# Altium schematic sheet 05-Switch_SFP_CM4_RJ45.SchDoc
size B; SheetNumber: 5; SheetTotal: 11
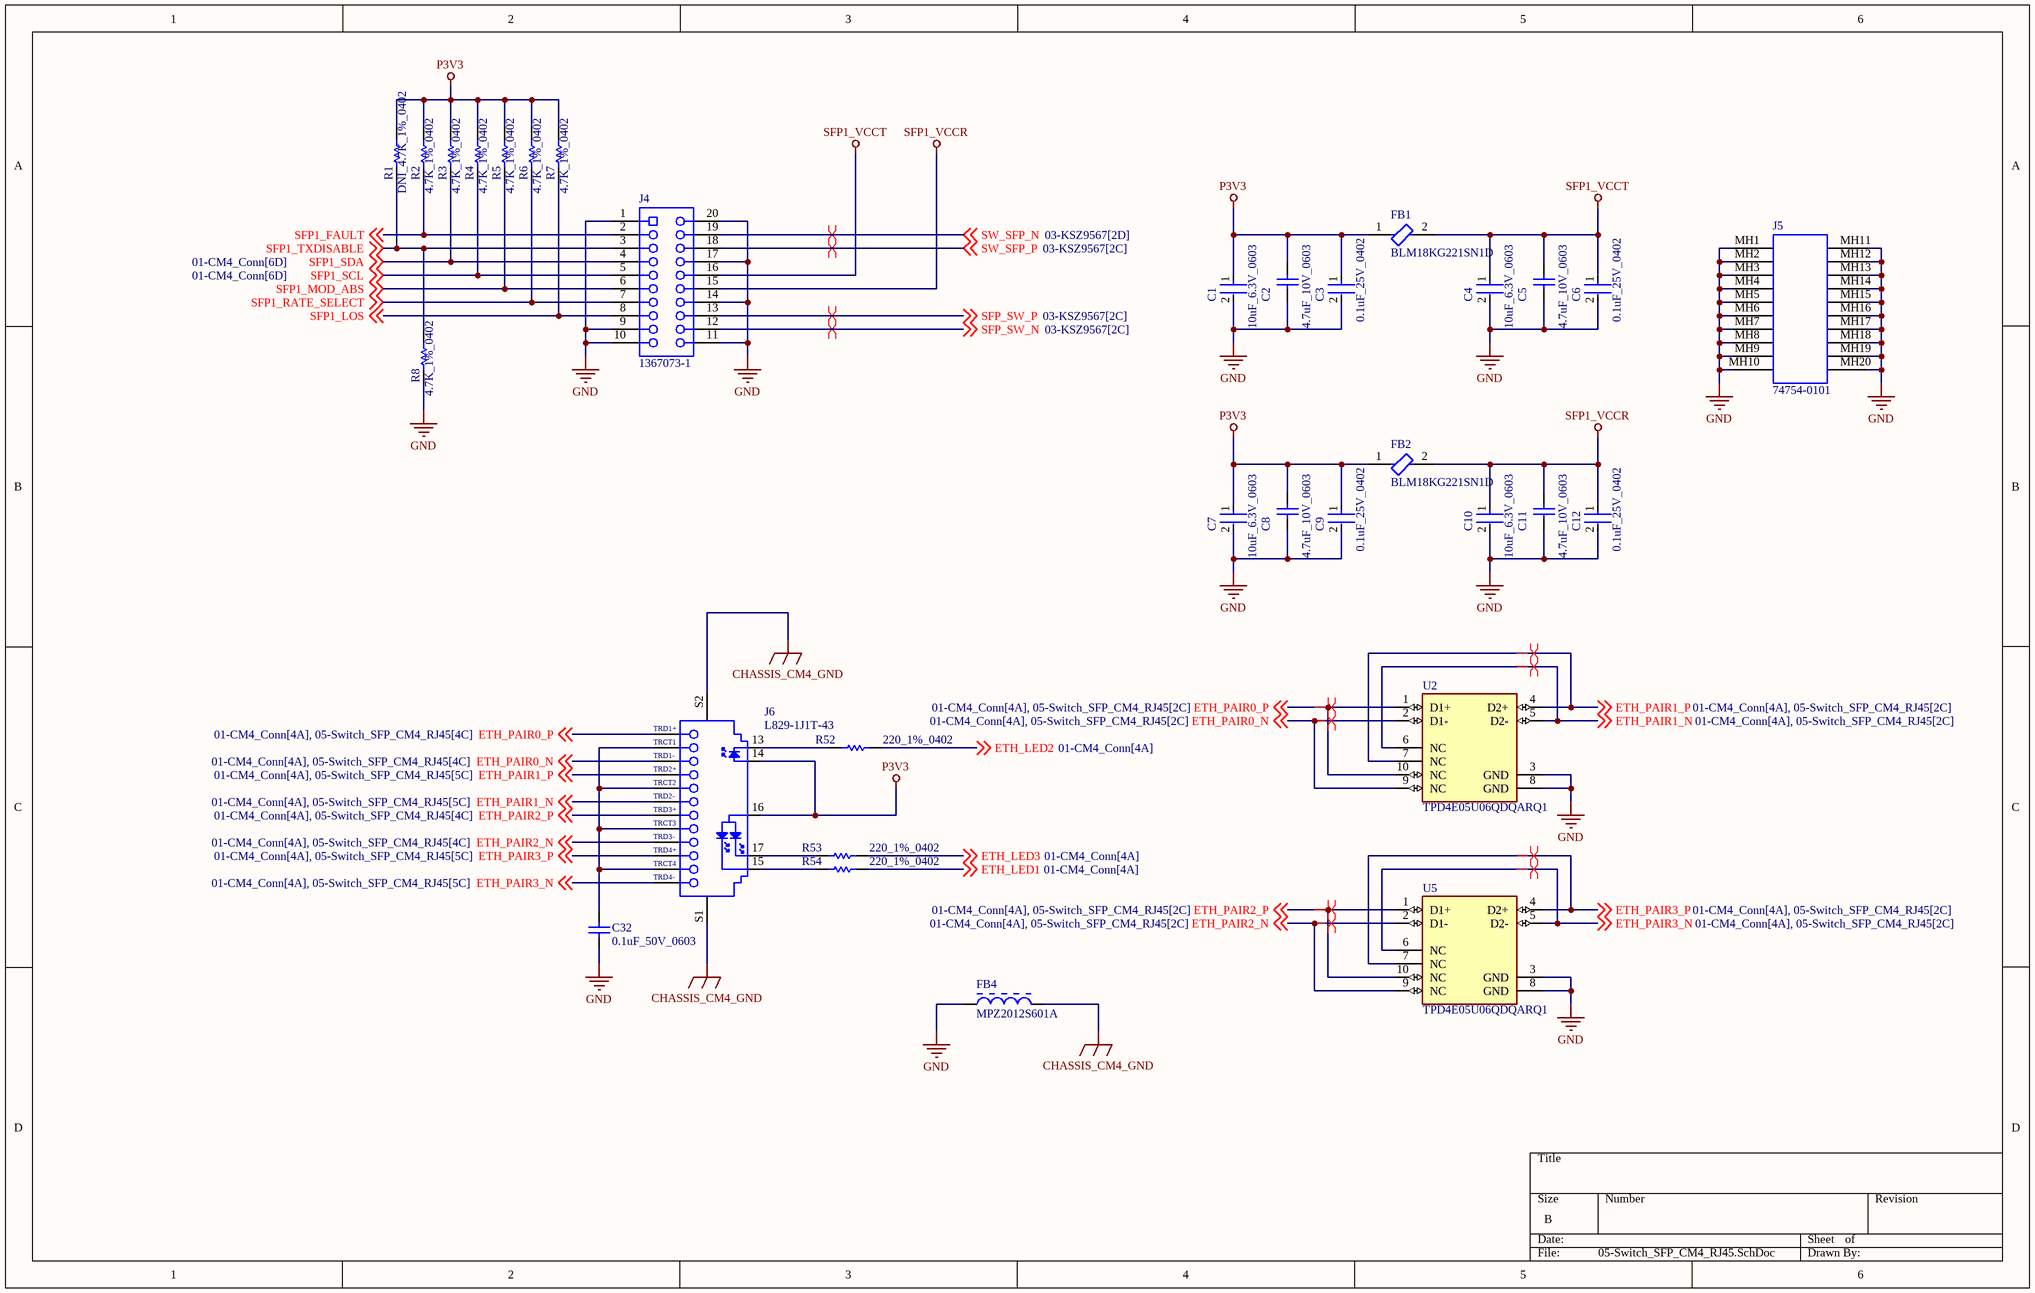
[diagram p0: 05-Switch_SFP_CM4_RJ45.SchDoc]

## Parts
C1  10uF_6.3V_0603  [FP-C0603C106M9PACTU-MFG]
C2  4.7uF_10V_0603  [CAPC1608X87X35NL15T15]
C3  0.1uF_25V_0402  [FP-0402-L_1_0_1-W_0_5_0_1-IPC_C]
C4  10uF_6.3V_0603  [FP-C0603C106M9PACTU-MFG]
C5  4.7uF_10V_0603  [CAPC1608X87X35NL15T15]
C6  0.1uF_25V_0402  [FP-0402-L_1_0_1-W_0_5_0_1-IPC_C]
C7  10uF_6.3V_0603  [FP-C0603C106M9PACTU-MFG]
C8  4.7uF_10V_0603  [CAPC1608X87X35NL15T15]
C9  0.1uF_25V_0402  [FP-0402-L_1_0_1-W_0_5_0_1-IPC_C]
C10  10uF_6.3V_0603  [FP-C0603C106M9PACTU-MFG]
C11  4.7uF_10V_0603  [CAPC1608X87X35NL15T15]
C12  0.1uF_25V_0402  [FP-0402-L_1_0_1-W_0_5_0_1-IPC_C]
C32  0.1uF_50V_0603  [CAPC1608X90X35ML10T15]
FB1  BLM18KG221SN1D  [FP-BLM18-0_15-t0_8-IPC_B]
FB2  BLM18KG221SN1D  [FP-BLM18-0_15-t0_8-IPC_B]
FB4  MPZ2012S601A  [TDK-MPZ2012_V]
J4  1367073-1  [TECO-1367073-1_V]
J5  74754-0101  [MOLX-74754-0101_V]
J6  L829-1J1T-43  [BELS-L829-1J1T-43_V]
R1  DNI_4.7K_1%_0402  [RESC1005X40X25NL10T10]  (no BOM)
R2  4.7K_1%_0402  [RESC1005X40X25NL10T10]
R3  4.7K_1%_0402  [RESC1005X40X25NL10T10]
R4  4.7K_1%_0402  [RESC1005X40X25NL10T10]
R5  4.7K_1%_0402  [RESC1005X40X25NL10T10]
R6  4.7K_1%_0402  [RESC1005X40X25NL10T10]
R7  4.7K_1%_0402  [RESC1005X40X25NL10T10]
R8  4.7K_1%_0402  [RESC1005X40X25NL10T10]
R52  220_1%_0402  [RESC1005X40X25NL05T10]
R53  220_1%_0402  [RESC1005X40X25NL05T10]
R54  220_1%_0402  [RESC1005X40X25NL05T10]
U2  TPD4E05U06QDQARQ1  [FP-DQA0010A-MFG]
U5  TPD4E05U06QDQARQ1  [FP-DQA0010A-MFG]

## Nets
CHASSIS_CM4_GND: FB4.2 J6.S1 J6.S2
GND: C1.2 C2.1 C3.2 C4.2 C5.1 C6.2 C7.2 C8.1 C9.2 C10.2 C11.1 C12.2 C32.1 FB4.1 J4.1 J4.9 J4.10 J4.11 J4.14 J4.17 J4.20 J5.MH1 J5.MH2 J5.MH3 J5.MH4 J5.MH5 J5.MH6 J5.MH7 J5.MH8 J5.MH9 J5.MH10 J5.MH11 J5.MH12 J5.MH13 J5.MH14 J5.MH15 J5.MH16 J5.MH17 J5.MH18 J5.MH19 J5.MH20 R8.2 U2.3(GND) U2.8(GND) U5.3(GND) U5.8(GND)
P3V3: C1.1 C2.2 C3.1 C7.1 C8.2 C9.1 FB1.1 FB2.1 J6.14 J6.16 R1.1 R2.1 R3.1 R4.1 R5.1 R6.1 R7.1
SFP1_VCCR: C10.1 C11.2 C12.1 FB2.2 J4.15
SFP1_VCCT: C4.1 C5.2 C6.1 FB1.2 J4.16
ETH_LED1: R54.2 ; off-sheet ETH_LED1
ETH_LED2: R52.2 ; off-sheet ETH_LED2
ETH_LED3: R53.2 ; off-sheet ETH_LED3
ETH_PAIR0_N: J6.3(TRD1-) U2.2(D1-) U2.9(NC) ; off-sheet ETH_PAIR0_N
ETH_PAIR0_P: J6.1(TRD1+) U2.1(D1+) U2.10(NC) ; off-sheet ETH_PAIR0_P
ETH_PAIR1_N: J6.6(TRD2-) U2.5(D2-) U2.6(NC) ; off-sheet ETH_PAIR1_N
ETH_PAIR1_P: J6.4(TRD2+) U2.4(D2+) U2.7(NC) ; off-sheet ETH_PAIR1_P
ETH_PAIR2_N: J6.9(TRD3-) U5.2(D1-) U5.9(NC) ; off-sheet ETH_PAIR2_N
ETH_PAIR2_P: J6.7(TRD3+) U5.1(D1+) U5.10(NC) ; off-sheet ETH_PAIR2_P
ETH_PAIR3_N: J6.12(TRD4-) U5.5(D2-) U5.6(NC) ; off-sheet ETH_PAIR3_N
ETH_PAIR3_P: J6.10(TRD4+) U5.4(D2+) U5.7(NC) ; off-sheet ETH_PAIR3_P
SFP1_FAULT: J4.2 R2.2 ; off-sheet SFP1_FAULT
SFP1_LOS: J4.8 R7.2 ; off-sheet SFP1_LOS
SFP1_MOD_ABS: J4.6 R5.2 ; off-sheet SFP1_MOD_ABS
SFP1_RATE_SELECT: J4.7 R6.2 ; off-sheet SFP1_RATE_SELECT
SFP1_SCL: J4.5 R4.2 ; off-sheet SFP1_SCL
SFP1_SDA: J4.4 R3.2 ; off-sheet SFP1_SDA
SFP1_TXDISABLE: J4.3 R1.2 R8.1 ; off-sheet SFP1_TXDISABLE
SFP_SW_N: J4.12 ; off-sheet SFP_SW_N
SFP_SW_P: J4.13 ; off-sheet SFP_SW_P
SW_SFP_N: J4.19 ; off-sheet SW_SFP_N
SW_SFP_P: J4.18 ; off-sheet SW_SFP_P
NetC32_2: C32.2 J6.2(TRCT1) J6.5(TRCT2) J6.8(TRCT3) J6.11(TRCT4)
NetJ6_13: J6.13 R52.1
NetJ6_15: J6.15 R54.1
NetJ6_17: J6.17 R53.1

## Layout directives
differential pair: ETH_PAIR0_N, ETH_PAIR0_P, ETH_PAIR1_N, ETH_PAIR1_P, ETH_PAIR2_N, ETH_PAIR2_P, ETH_PAIR3_N, ETH_PAIR3_P, SFP_SW_N, SFP_SW_P, SW_SFP_N, SW_SFP_P

## Library data of the parts
C1 C4 C7 C10 = CMP-2006-02285-3: CAP CER 10UF 6.3V X5R 0603; Manufacturer Part Number: C0603C106M9PACTU; Manufacturer: Kemet; Material: Ceramic; Temperature Coefficient: 15%; Tolerance: 20%; Category: Cap; Height: 0.9mm; Digikey Description: CAP CER 10UF 6.3V X5R 0603; Mouser Description: In a Pack of 10, KEMET 0603 (1608M) 10µF MLCC 6.3V dc ±20% SMD C0603C106M9PACTU; Voltage Rating: 6.3V; Device Class L2: Capacitors; Temperature Range Low: -55°C; Temperature Characteristic: X5R; ComponentLink2Description: Datasheet; Ipc Land Pattern Name: CAPC16080X80; ComponentLink2URL: http://www.kemet.com/Lists/ProductCatalog/Attachments/19/KEM_C1006_X5R_SMD.pdf; Capacitance: 10uF; Temperature Range High: +85°C; Device Class L3: Ceramic Capacitors; RoHS: TRUE; Automotive: No; Value: 10uF; Temperature: -55°C to +85°C; Device Class L1: Passive Components; Package: C0603C106M9PACTU; Lead Free: Yes; Octopart: https://octopart.com/c0603c106m9pactu-kemet-8375727
C2 C5 C8 C11 = CMP-2006-03238-1: Part Number: C0603C475K8PACTU; Manufacturer: Kemet
C3 C6 C9 C12 = CMP-2008-02519-2: General Purpose Ceramic Capacitor, 0402, 100nF, 10%, X7R, 15%, 25V; Package Quantity: 1; Capacitance: 100nF; Min Operating Temperature: -55°C; Voltage: 25V; Voltage Rating: 25V; Construction: Flat; Max Operating Temperature: 125°C; Radiation Hardening: No; Depth: 0.5mm; Thickness: 0.022inch; Voltage Rating (DC): 25V; Number of Pins: 2; Lead Free: Lead Free; Series: -; REACH SVHC: No SVHC; Length: 1mm; Dielectric: X7R; RoHS Compliant: Yes; Mount: Surface Mount; Packaging: Tape and Reel; Case/Package: 0402; Case Code (Imperial): 0402; Termination: SMD/SMT; Width: 0.02inch; Case Code (Metric): 1005; Tolerance: 10%
C32 = CMP-2100-03643-1: Chip Capacitor, 0.1 uF, +/- 10%, 50 V, -55 to 125 degC, 0603 (1608 Metric), RoHS, Tape and Reel; Manufacturer: Murata; Dielectric Material: Ceramic; Voltage Rating: 50V; Capacitance: 100nF; Dielectric: X7R; Insulation Resistance: 10GR; Case Code (Metric): 1608; Lead Free: LeadFree; Depth: 0.8mm; Number of Pins: 2; Radiation Hardening: No; Case/Package: 0603; Manufacturer URL: http://www.murata.com/; Packaging: TapeandReel; Length: 1.6mm; Contact Plating: Tin; Datasheet URL: http://psearch.en.murata.com/capacitor/product/GRM188R71H104KA93%23.pdf; Tolerance: 10%; Case Code (Imperial): 0603; Min Operating Temperature: -55degC; RoHSCompliant: true; Voltage: 50V; Termination: SMD/SMT; Mount: SurfaceMount; Material: Ceramic; Package Quantity: 1; Height: 0.8mm; Thickness: 0.035inch; REACH SVHC: NoSVHC; Max Operating Temperature: 125degC; Width: 0.8mm; Package Reference: 0603; Voltage Rating (DC): 50V; Datasheet Version: 42675.0; Package Description: 2-Pin Surface Mount Device, Body 1.6 x 0.8 mm
FB1 FB2 = CMP-0686-00556-7: Chip Ferrite Bead, 0603, 220Ω @ 100MHz, 0.05Ω, 25%, 2.2A; DC Resistance (DCR): 50mR; Number of Circuits: 1; Impedance: 220R; Current Rating: 2.2A; Material: Ferrite; Test Frequency: 100MHz; Depth: 0.8mm; Series: BLM18K; RoHS Compliant: Yes; Termination: SMD/SMT; Max Current Rating: 2.2A; Case Code (Metric): 1608; Radiation Hardening: No; Number of Pins: 2; Length: 1.6mm; Lead Free: Lead Free; Package Quantity: 1; Height: 0.8mm; Core Material: Ferrite; Inductor Type: FERRITE BEAD; Min Operating Temperature: -55°C; Case/Package: 0603; Case Code (Imperial): 0603; Number of Lines: 1; Packaging: Tape and Reel; REACH SVHC: No SVHC; Max Operating Temperature: 125°C; Military Standard: Not; DC Resistance-Max: 50mR; Width: 0.8mm; DC Current: 2.2A; Max DC Current: 2.2A; Tolerance: 25%; Weight: 7.1E-05oz
FB4 = CMP-2000-05400-1: Chip Bead for Power Line, 600 Ohm, +/- 25%, 2 A, -55 to 125 degC, 2-Pin SMD (0805), RoHS, Tape and Reel; Manufacturer: TDK; Maximum DC Current: 2A; Impedance: 600Ohms; Test Frequency: 100MHz; Case Length: 2mm; Maximum DC Resistance: 100mOhms; Case Height: 0.85mm; Case Width: 1.25mm; Factory Pack Quantity: 4000; Operating Temperature Range: -55Cto+125C; Packaging: Reel; Datasheet URL: https://datasheet.ciiva.com/23763/1750041-23763249.pdf; Manufacturer URL: http://www.tdk.com/; Product Category: EMIFilterBeads,Chips&Arrays; Tolerance: 25%; Product: FerriteChipBeads; Package / Case: 0805(2012metric); RoHS: Details; Dimensions: 1.25mmWx2mmLx0.85mmH; Datasheet Version: Jul-13; Termination Style: SMD/SMT; Package Reference: 805; Brand: TDK; Package Description: 2-Pin Surface Mount Device, Body 2 x 1.25 mm
J4 = CMP-2000-05488-1: Female Connector, Pitch 0.8 mm, 2 x 10 Position, Height 5.4 mm, -55 to 85 degC, RoHS, Tape and Reel; Manufacturer: TE Connectivity; Product Training Modules: HighSpeedPluggableI/OSolutions; 3D Model: 1367073-1.pdf; Connector Type: SFP; Other Names: A97430DKR; Mating Products: 516-2084-ND / -TXRXOPTICALSFF1.25GBDISCSI; Dynamic Catalog: SFPConnectors; Featured Product: HighSpeedPluggableI-OSolutions; Connector Style: Receptacle; Associated Product: A103997CT-ND / -CONNSFPCAGESINGLEW/OPIPE / A103997TR-ND / -CONNSFPCAGESINGLEW/OPIPE / 1367645-3-ND / -CONNCAGE&HEATSINKSGLPORTTIN / 1367645-2-ND / -CONNCAGE&HEATSINKSGLPORTTIN / 1888424-1-ND / -CONNCAGE1X2SFPENHANCEDEMI / 1367643-1-ND / -CONNCAGESNGLPORTDBLSIDETIN / 1489962-1-ND / -CONNSFPCAGESINGLEW/OPIPE / 1367645-1-ND / -CONNCAGE&HEATSINKSGLPORTTIN / A99375-ND / -CONNSFPCAGE1X4PIN-IN-PASTE / A97412CT-ND / -CONNSFPLOWERCAGEPCB / More...; Number of Positions: 20; Package Reference: 1367073-1; Package Description: Female Connector, Pitch 0.8 mm, 2 x 10 Position, Height 5.4 mm; RoHS Information: 1367073-1StatementofCompliance; Contact Finish: Gold; Datasheet URL: http://www.te.com/commerce/DocumentDelivery/DDEController?Action=showdoc&DocId=Customer+Drawing%7F1367073%7FK%7Fpdf%7FEnglish%7FENG_CD_1367073_K.pdf%7F1367073-1; Datasheet Version: Rev. K, 12/2012; Contact Finish Thickness: 15µin(0.38µm); Category: Connectors,Interconnects; Mounting Type: SurfaceMount,RightAngle; Mounting Technology: SurfaceMount; Packaging: Digi-Reel®; Manufacturer URL: http://www.te.com/; Family: PluggableConnectors; Standard Package: 1; Termination: Solder
J5 = CMP-1704-00003-3: SFP+ Cage, Single Port, Height 10.85 mm, Tail Height 3.05 mm, -40 to 85 degC, RoHS, Tray; RoHSCompliant: True; ComponentLink3URL: http://www.molex.com/pdm_docs/sd/747540101_sd.pdf; Width: 49 mm; Height: 10.85 mm; Mounting Technology: Through Hole; ComponentLink2Description: Datasheet; ComponentLink3Description: Package Specification; DatasheetVersion: Rev. Jul-15; Package Quantity: 1152; PackageDescription: SFP+ Cage, Single Port, Height 10.85 mm, Tail Height 3.05 mm; Radiation Hardening: No; PackageVersion: Rev. J, 02/2015; ComponentLink1Description: Manufacturer URL; PartNumber: 74754-0101; ComponentLink1URL: http://www.molex.com/; Packaging: Tray; Length: 15.9 mm; ComponentLink2URL: http://www.molex.com/webdocs/datasheets/pdf/en-us/0747540101_IO_CONNECTORS.pdf
J6 = CMP-1715-00001-1: Gigabit MagJack(R) Ultra Low Profile, 10/100/1000 Base-T, 19-Pin THD, RoHS, Tray; Width: 24.13 mm; RoHSCompliant: True; PartNumber: L829-1J1T-43; Case/Package: Metal; Mount: Through Hole; ComponentLink1Description: Manufacturer URL; Height: 11.3 mm; Package Quantity: 60; Packaging: Tray; Length: 17.78 mm; PackageDescription: 19-Pin Through Hole Device, Body 23.94 x 17.58 mm, Pitch 2.03 mm; ComponentLink2URL: http://belfuse.com/pdfs/L829-1J1T-43.pdf; ComponentLink1URL: http://belfuse.com/ethernet/; Mounting Technology: Through Hole; DatasheetVersion: Rev. G; Pins: 8; ComponentLink2Description: Datasheet
R1-R8 = CMP-2002-05217-1: Manufacturer: Bourns; Part Number: CR0402-FX-4701GLF
R52-R54 = CMP-2002-07959-1: Manufacturer: Yageo / Phycomp; Part Number: RC0402JR-07220RL
U2 U5 = CMP-04985-000004-1: TVS DIODE 5.5V 14V 10USON; Manufacturer: Texas Instruments; Direction: Unidirectional; Standoff Height: 0mm; Capacitance: 0.5pF; Number Of Channels: 4; Breakdown Voltage: 6.4V; Peak Pulse Power: 2.5W; Automotive Grade: Grade 1; Value: 0.5pF; Interface: USB,Ethernet,LVDS,Other; Peak Pulse Current: 2.5A; Operating Supply Voltage: 5.5V; Reverse Standoff Voltage: 5.5V; Package: DQA0010A; Temperature Range Low: -40°C; Temperature Range High: +125°C; Ambient Temperature Range Low: -40°C; Device Class L1: Circuit Protection; Clamping Voltage: 14V; Manufacturer Part Number: TPD4E05U06QDQARQ1; Device Class L2: ESD and Circuit Protection ICs; Octopart: https://octopart.com/tpd4e05u06qdqarq1-texas+instruments-48523459; Device Class L3: unset; Height: 0.55mm; Automotive: Yes; ComponentLink2Description: Datasheet; RoHS: TRUE; Ambient Temperature Range High: +125°C; Category: IC; Mouser Description: Automotive 4-Channel ESD Protection Solution for SuperSpeed (up to 5 Gbps) Interface 10-USON -40 to 125; Temperature: -40°C to +125°C; ComponentLink2URL: http://www.ti.com/lit/ds/symlink/tpd4e05u06-q1.pdf; Digikey Description: TVS DIODE 5.5V 14V 10USON; Lead Free: Yes